# EAGLE design teleCommunication (EAGLE 4.16)
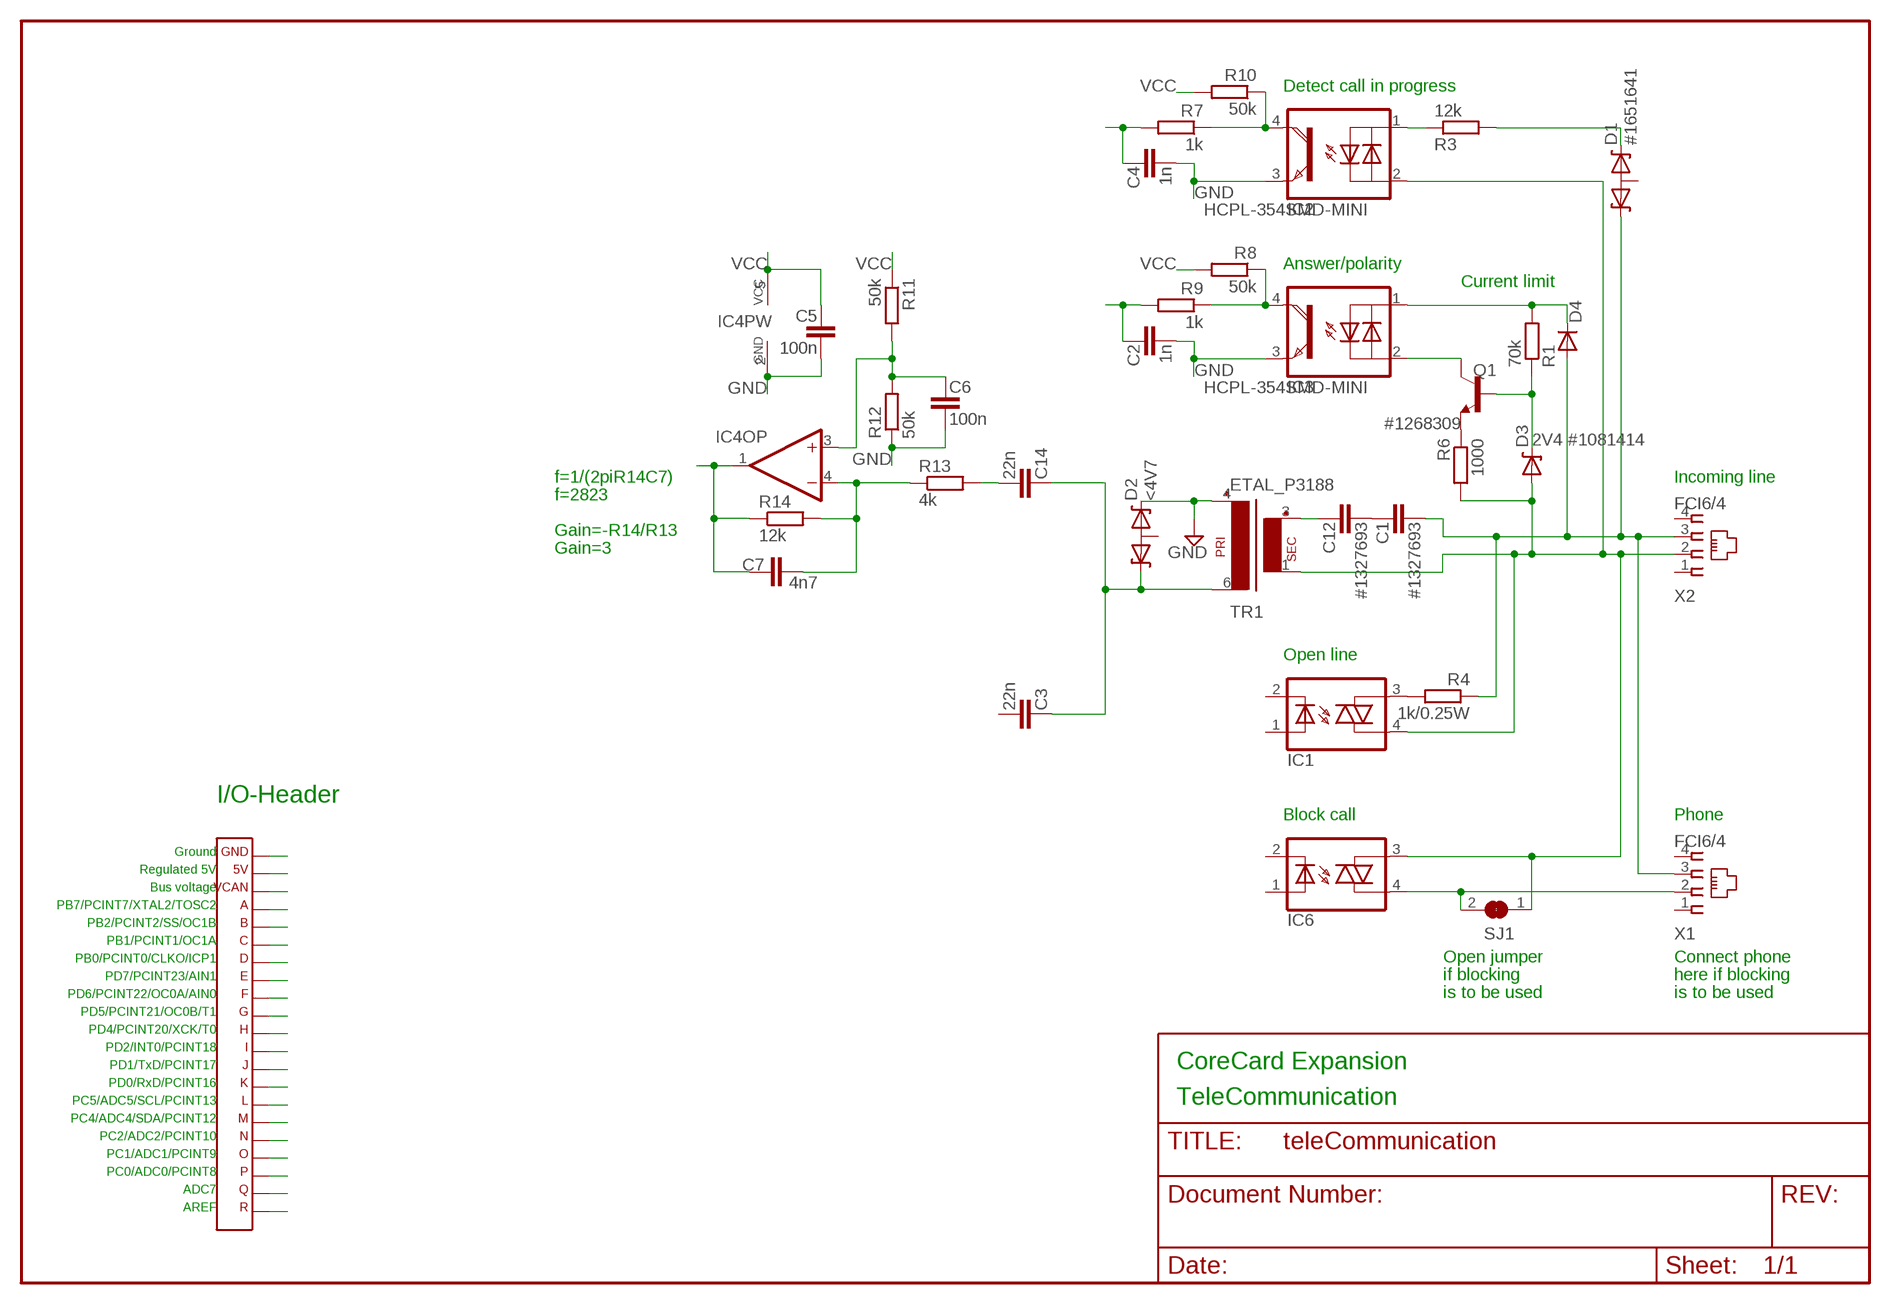
[diagram p0: schematic, sheet 1]

## Parts
C1  #1327693  C-EUC0805  [C0805]
C2  1n  C-EUC0603  [C0603]
C3  22n  C-EUC0805  [C0805]
C4  1n  C-EUC0603  [C0603]
C5  100n  C-EUC0603  [C0603]
C6  100n  C-EUC0603  [C0603]
C7  4n7  C-EUC0603  [C0603]
C12  #1327693  C-EUC0805  [C0805]
C14  22n  C-EUC0805  [C0805]
D1  #1651641  TVSSOT23  [SOT23]
D2  <4V7  TVSSOT23  [SOT23]
D3  2V4 #1081414  ZENERSOT23  [SOT23]
D4  DIODESOT23  [SOT23]
IC1  S2S3ADYFSMD  [SMD]
IC2  HCPL-354SMD-MINI  [SMD-MINI]
IC3  HCPL-354SMD-MINI  [SMD-MINI]
IC4  NCS2001SQ2T2SOT23-5  [SOT23-5]
IC6  S2S3ADYFSMD  [SMD]
Q1  #1268309  NPNSOT23  [SOT23]
R1  70k  R-EUR0805  [R0805]
R3  12k  R-EUR0805  [R0805]
R4  1k/0.25W  R-EUR0805  [R0805]
R6  1000  R-EUR0805  [R0805]
R7  1k  R-EUR0603  [R0603]
R8  50k  R-EUR0603  [R0603]
R9  1k  R-EUR0603  [R0603]
R10  50k  R-EUR0603  [R0603]
R11  50k  R-EUR0603  [R0603]
R12  50k  R-EUR0603  [R0603]
R13  4k  R-EUR0603  [R0603]
R14  12k  R-EUR0603  [R0603]
SJ1  SJ_NC  [SJ_NC]
TR1  ETAL_P3188  [ETAL_P3188]
X1  FCI6/4  [FCI6/4]
X2  FCI6/4  [FCI6/4]
X3  CORE_IOHEADEXP  [CORE_IOHEAD_NOSILC]

## Nets
CUR_DIV: C6.1 IC4.3(OP:+IN) R11.2 R12.2
EXP_A: X3.4
EXP_B: X3.5
EXP_C: X3.6
EXP_D: X3.7
EXP_E: X3.8
EXP_F: X3.9
EXP_G: X3.10
EXP_H: X3.11
EXP_I: X3.12
EXP_J: X3.13
EXP_K: X3.14
EXP_L: X3.15
EXP_M: X3.16
EXP_N: X3.17
EXP_O: X3.18
EXP_P: X3.19
EXP_Q: X3.20
EXP_R: X3.21
GND: C2.2 C4.2 C5.2 C6.2 D2.1(C1) IC2.3(E) IC3.3(E) IC4.2(PW:GND) R12.1 TR1.4 X3.1
N$1: IC6.4(A2) SJ1.2 X1.2
N$3: C1.1 C12.2
N$4: D4.3(C) IC3.1(A) R1.2
N$5: D3.3(C) Q1.1(B) R1.1
N$6: IC3.2(C) Q1.3(C)
N$7: IC2.1(A) R3.1
N$8: D1.1(C1) R3.2
N$9: C12.1 TR1.3
N$10: Q1.2(E) R6.1
N$11: C1.2 D1.2(C2) D4.1(A) R4.1 X1.3 X2.3
N$12: IC2.4(COL) R7.1 R10.1
N$13: IC1.3(A1) R4.2
N$14: IC3.4(COL) R8.1 R9.1
N$15: C3.1 C14.1 D2.2(C2) TR1.6
N$16: C14.2 R13.2
N$20: D3.1(A) IC1.4(A2) IC2.2(C) IC6.3(A1) R6.2 SJ1.1 TR1.1 X2.2
OP_NEG: C7.1 IC4.4(OP:-IN) R13.1 R14.2
RENAME_NET: C4.1 R7.2
RENAME_NET1: C2.1 R9.2
RENAME_NET2: C7.2 IC4.1(OP:OUT) R14.1
V_CAN: X3.3
VCC: C5.1 IC4.5(PW:VCC) R8.2 R10.2 R11.1 X3.2
Unconnected: C3.2 D1.3(A) D2.3(A) IC1.1(A) IC1.2(C) IC6.1(A) IC6.2(C) X1.1 X1.4 X2.1 X2.4

## Notes on the sheet
- Detect call in progress
- Answer/polarity
- Current limit
- f=1/(2piR14C7) | Incoming line
- f=2823
- Gain=-R14/R13
- Gain=3
- Open line
- I/O-Header
- Block call | Phone
- Ground
- Regulated 5V
- Bus voltage
- PB7/PCINT7/XTAL2/TOSC2
- PB2/PCINT2/SS/OC1B
- PB1/PCINT1/OC1A
- PB0/PCINT0/CLKO/ICP1 | Open jumper | Connect phone
- PD7/PCINT23/AIN1 | if blocking | here if blocking
- PD6/PCINT22/OC0A/AIN0 | is to be used | is to be used
- PD5/PCINT21/OC0B/T1
- PD4/PCINT20/XCK/T0
- PD2/INT0/PCINT18
- PD1/TxD/PCINT17 | CoreCard Expansion
- PD0/RxD/PCINT16
- PC5/ADC5/SCL/PCINT13 | TeleCommunication
- PC4/ADC4/SDA/PCINT12
- PC2/ADC2/PCINT10
- PC1/ADC1/PCINT9
- PC0/ADC0/PCINT8
- ADC7
- AREF

## Library data of the parts
C1-C7 C12 C14 = rcl:C-EU
D1 D2 = diode:TVS
D3 = diode:ZENER
D4 = diode:DIODE: DIODE ultra fast rectifier, 3 A
IC1 IC6 = optocoupler-S2S3ADYF:S2S3ADYF
IC2 IC3 = optocoupler_hcpl-354:HCPL-354
IC4 = NCS2001:NCS2001SQ2T2
Q1 = transistor:NPN
R1 R3 R4 R6-R14 = rcl:R-EU
SJ1 = jumper:SJ_NC: SMD solder JUMPER
TR1 = etal_trafo:ETAL_P3188
X1 X2 = fci-modular:FCI6/4
X3 = expboard:CORE_IOHEAD: CoreCard IO-header for expansion cards

## Board
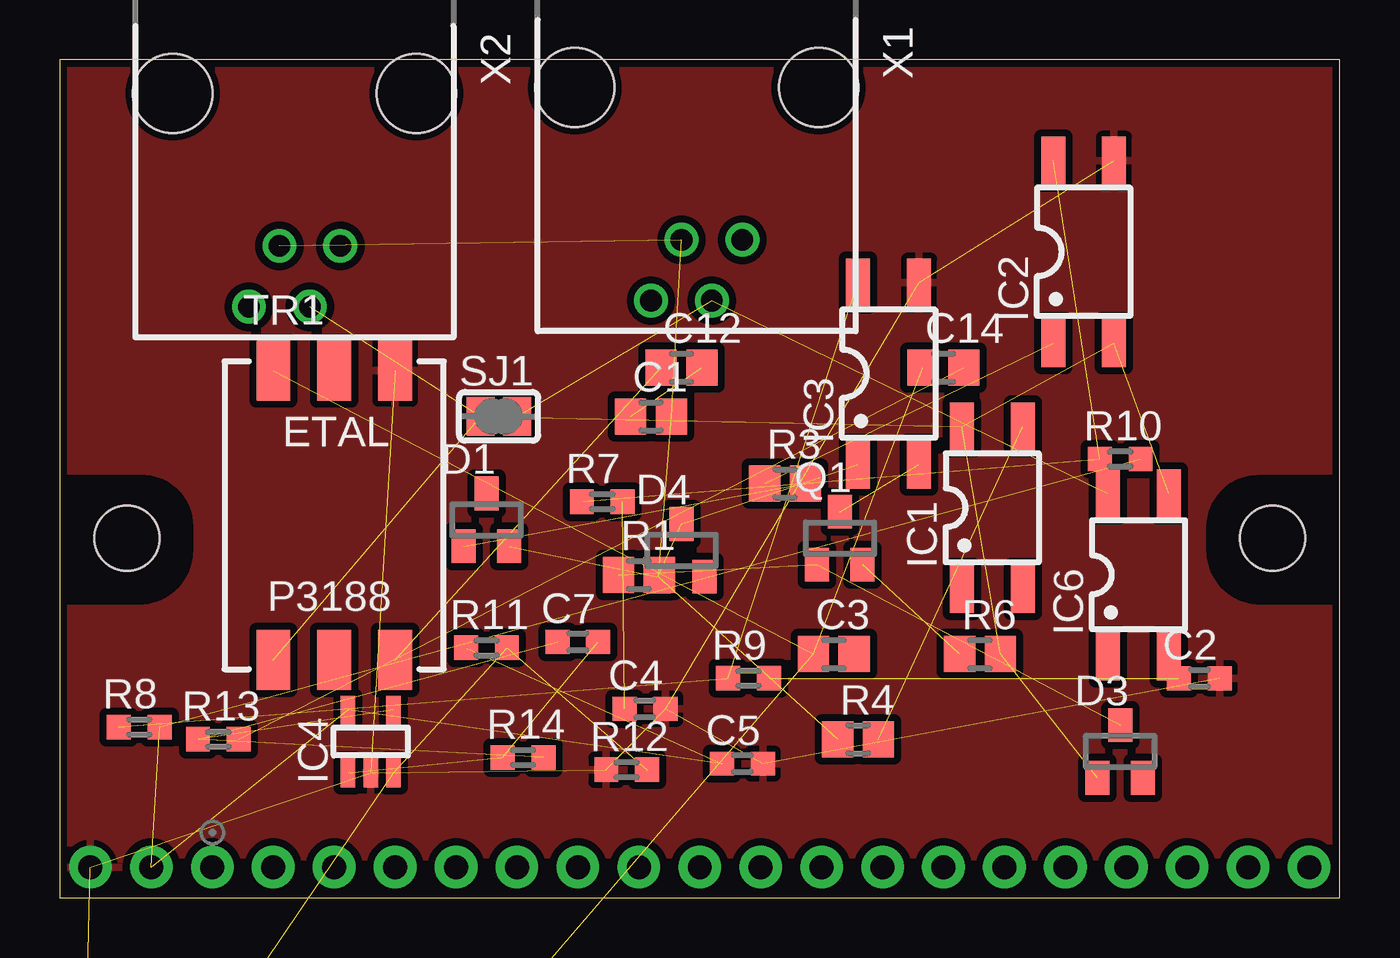
[diagram p1: board, top side]
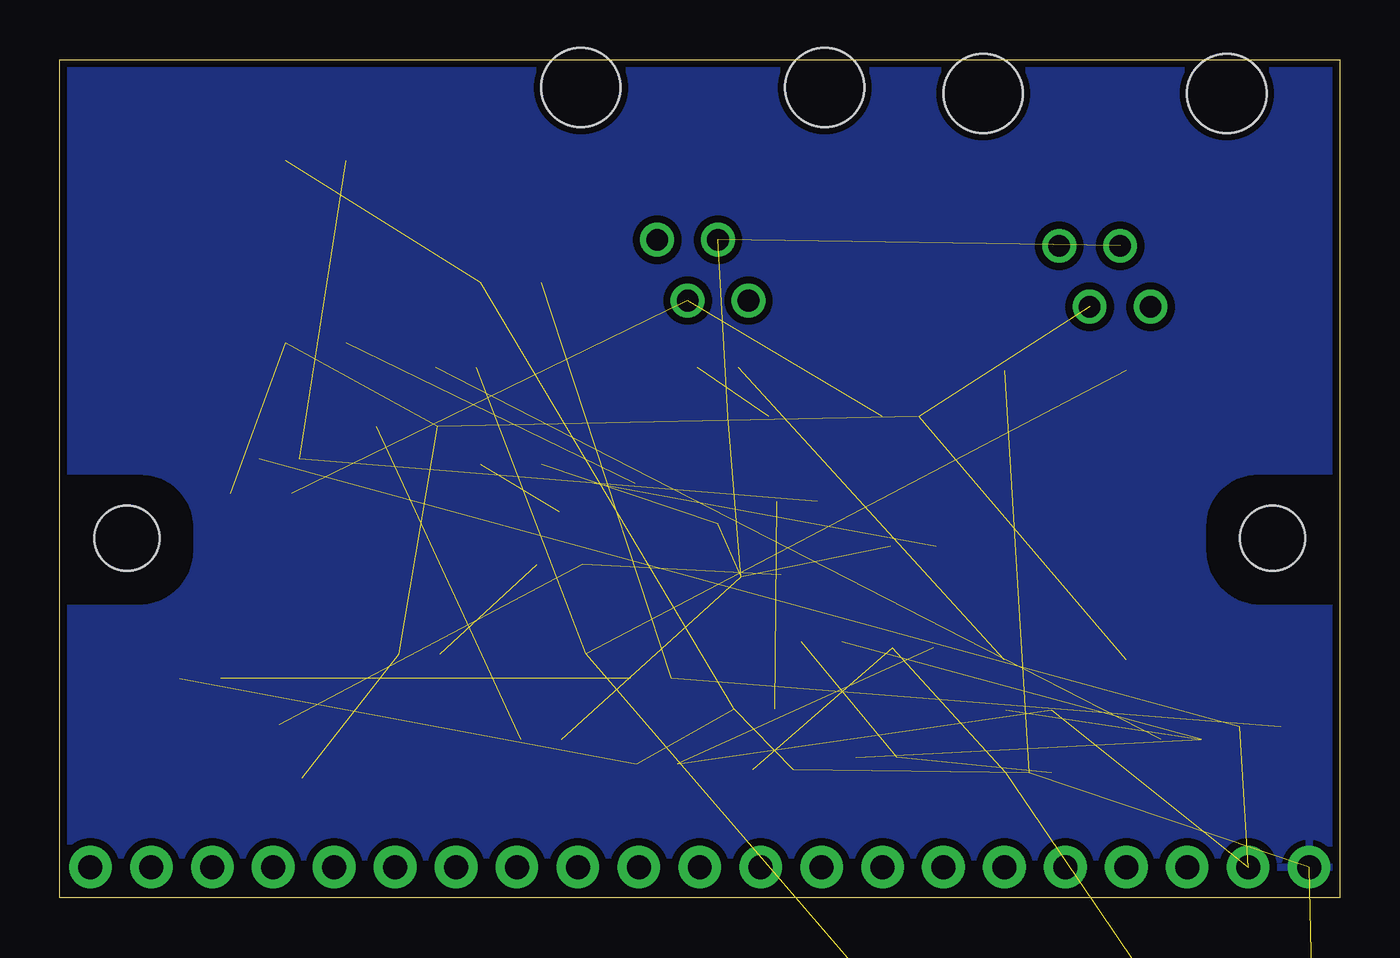
[diagram p2: board, bottom side, seen from below]

Size 53.34 x 34.92 mm. Coordinates in mm from the lower left corner, seen from the top.
Outline: 0,0 53.34,0 53.34,34.92 0,34.92 0,0
Copper layers (1*16): Top 0.035mm / dielectric 1.5mm / Bottom 0.035mm
Design rules "default": minimum track width 10mil, minimum drill 0.4mm, track to track 10mil, track to pad 10mil, pad to pad 10mil, via to via 10mil, smd to smd 8mil, copper to edge 10mil, drill to drill 8mil, minimum pad ring 10mil, minimum via ring 10mil, stop-mask expansion 4mil, vias tented up to drill 18mil, thermal gap 10mil
Holes 2.7 mm at 50.55,14.99 2.79,14.99

### Footprints (pad centres in the part's own frame; a part is rotated, then mirrored left to right if it is on the bottom)
C0805 = smd 1.3 x 1.5: 1 -0.85,0; 2 0.85,0
C0603 = smd 1 x 1: 1 -0.85,0; 2 0.85,0
SOT23 = smd 1 x 1.4: 1 -0.95,-1.1; 2 0.95,-1.1; 3 0,1.1
SMD = smd 1 x 2: 1 -1.016,-3.395; 2 1.524,-3.395; 3 1.524,3.395; 4 -1.016,3.395
SMD-MINI = smd 1 x 2: 1 -2.54,-3.795; 2 0,-3.795; 3 0,3.795; 4 -2.54,3.795
SOT23-5 = smd 0.6 x 1.2: 1 -0.95,-0.636; 2 0,-0.636; 3 0.95,-0.636; 4 0.95,1.976; 5 -0.95,1.976
R0805 = smd 1.3 x 1.5: 1 -0.85,0; 2 0.85,0
R0603 = smd 0.991 x 1.016: 1 -0.85,0; 2 0.85,0
SJ_NC = smd 1.168 x 1.6: 1 -0.762,0; 2 0.762,0
ETAL_P3188 = smd 1.4 x 2.5: 1 0,-5.08; 2 2.54,-5.08; 3 5.08,-5.08; 4 5.08,6.985; 5 2.54,6.985; 6 0,6.985
FCI6/4 = drill 0.9 round: 1 -8.636,-2.794; 2 -7.366,-0.254; 3 -6.096,-2.794; 4 -4.826,-0.254 | hole 3.3: -11.811,-9.144; -1.651,-9.144
CORE_IOHEAD_NOSILC = drill 1 pad 1.778 round: 1 25.4,0; 2 22.86,0; 3 20.32,0; 4 17.78,0; 5 15.24,0; 6 12.7,0; 7 10.16,0; 8 7.62,0; 9 5.08,0; 10 2.54,0; 11 0,0; 12 -2.54,0; 13 -5.08,0; 14 -7.62,0; 15 -10.16,0; 16 -12.7,0; 17 -15.24,0; 18 -17.78,0; 19 -20.32,0; 20 -22.86,0; 21 -25.4,0

### Placement (x,y rotation side)
C1  24.64,20.07 0 top
C2  47.5,9.14 0 top
C3  32.26,10.16 0 top
C4  24.38,7.87 0 top
C5  28.45,5.59 0 top
C6  0,-16.51 0 top  (outside the outline)
C7  21.59,10.67 0 top
C12  25.91,22.1 0 top
C14  36.83,22.1 0 top
D1  17.78,15.75 0 top
D2  0,-24.13 0 top  (outside the outline)
D3  44.2,6.1 0 top
D4  25.91,14.48 0 top
IC1  38.61,16.26 0 top
IC2  43.94,26.92 0 top
IC3  35.81,21.84 0 top
IC4  12.95,5.84 0 top
IC6  44.7,13.46 0 top
Q1  32.51,14.99 0 top
R1  24.13,13.46 0 top
R3  30.23,17.27 0 top
R4  33.27,6.6 0 top
R6  38.35,10.16 0 top
R7  22.61,16.51 0 top
R8  3.3,7.11 0 top
R9  28.7,9.14 0 top
R10  44.2,18.29 0 top
R11  17.78,10.41 0 top
R12  23.62,5.33 0 top
R13  6.6,6.6 0 top
R14  19.3,5.84 0 top
SJ1  18.29,20.07 0 top
TR1  8.89,14.99 0 top
X1  19.81,24.64 180 top
X2  3.05,24.38 180 top
X3  26.67,1.27 0 bottom

### Tracks (layer width: path | path; a pad name or v marks a point on that pad's centre or on a via)
CUR_DIV  (3 unrouted)
GND  (10 unrouted)
  pour Bottom (isolate 0.305, rank 3): 0,34.92 53.34,34.92 53.34,17.78 50.04,17.78 arc90 47.62,15.49 47.62,14.48 arc90 50.04,12.06 53.34,12.06 53.34,1.14 0,1.14 0,12.06 3.3,12.06 arc90 5.71,14.48 5.71,15.49 arc90 3.43,17.78 0,17.78
  pour Top (isolate 0.305, rank 3): 0,34.92 53.34,34.92 53.34,17.78 50.04,17.78 arc90 47.62,15.49 47.62,14.48 arc90 50.04,12.06 53.34,12.06 53.34,1.14 0,1.14 0,12.06 3.3,12.06 arc90 5.71,14.48 5.71,15.49 arc90 3.43,17.78 0,17.78
N$1  (2 unrouted)
N$3  (1 unrouted)
N$4  (2 unrouted)
N$5  (2 unrouted)
N$6  (1 unrouted)
N$7  (1 unrouted)
N$8  (1 unrouted)
N$9  (1 unrouted)
N$10  (1 unrouted)
N$11  (5 unrouted)
N$12  (2 unrouted)
N$13  (1 unrouted)
N$14  (2 unrouted)
N$15  (3 unrouted)
N$16  (1 unrouted)
N$20  (7 unrouted)
OP_NEG  (3 unrouted)
RENAME_NET  (1 unrouted)
RENAME_NET1  (1 unrouted)
RENAME_NET2  (2 unrouted)
VCC  (5 unrouted)

### Text on the board
Document: Top is component side | Expansion will be mounted bottom to bottom with CoreCard | Change vertical dimension to fit | Remove I/O-header silcscreen if neccesary | Remove mounting holes if neccesary
tDocu: - | + | A | B | C | D | E | F | G | H | I | J | K | L | M | N | O | P | Q | R